# Altium schematic sheet Control.SchDoc
size A4
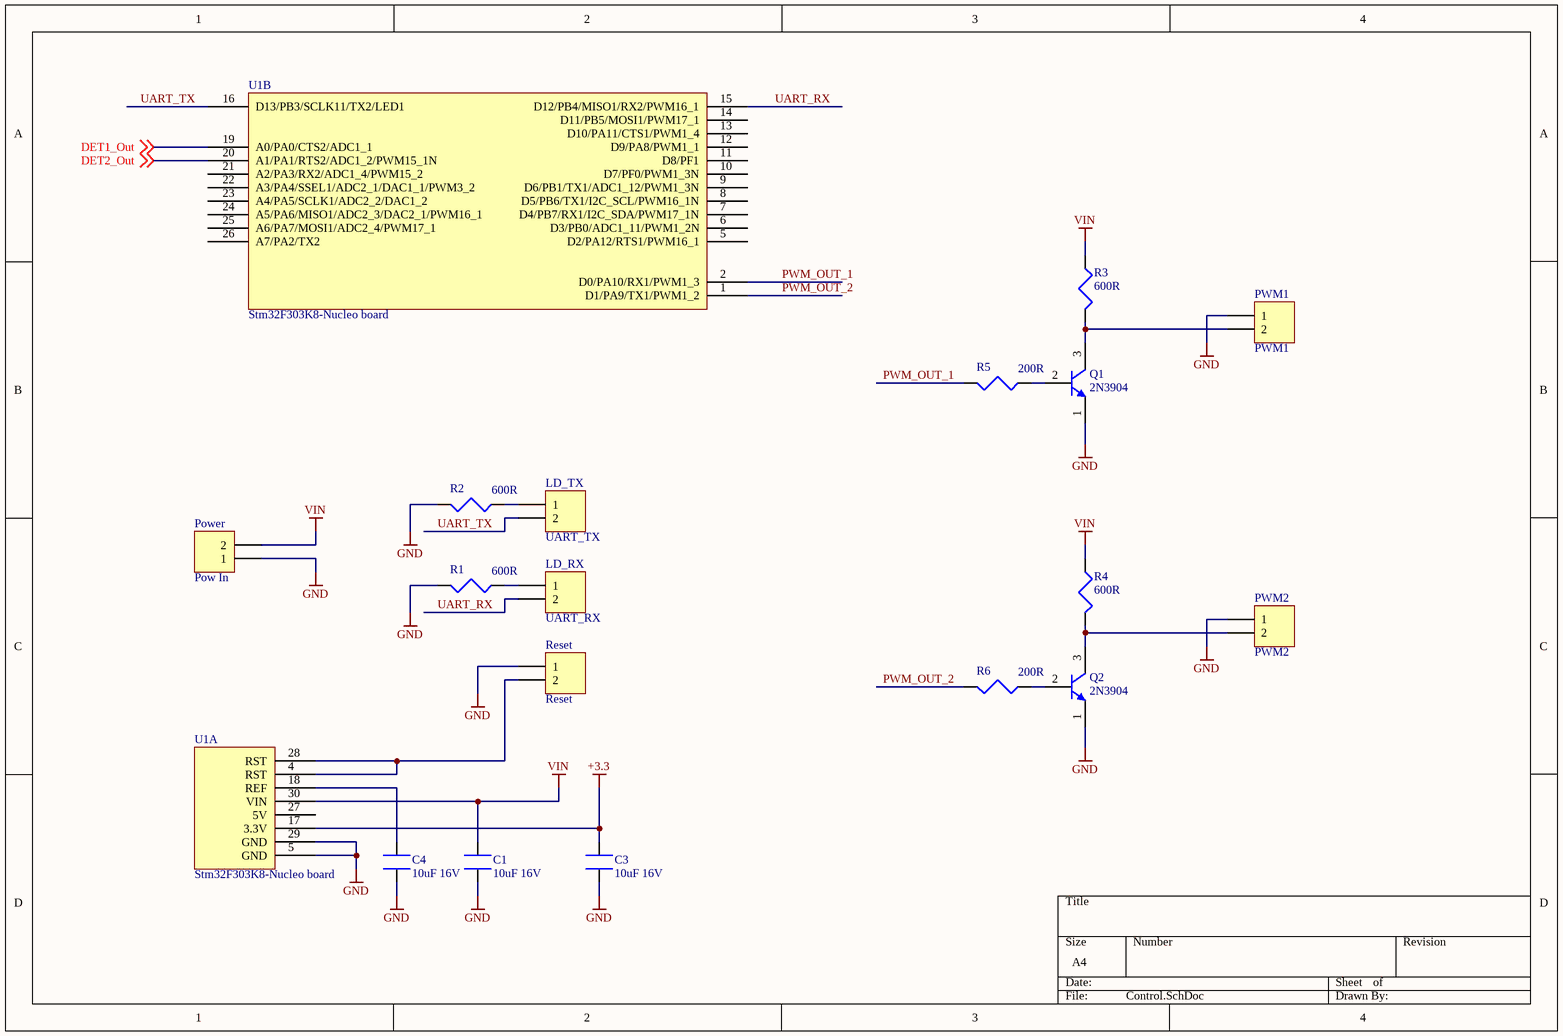
[diagram p0: Control.SchDoc]

## Parts
C1  10uF 16V  [0805_C]
C3  10uF 16V  [0805_C]
C4  10uF 16V  [0805_C]
LD_RX  UART_RX  [HDR1X2]
LD_TX  UART_TX  [HDR1X2]
Power  Pow In  [HDR1X2]
PWM1  PWM1  [HDR1X2]
PWM2  PWM2  [HDR1X2]
Q1  2N3904  [ONSC-TO-92-3-29-11]
Q2  2N3904  [ONSC-TO-92-3-29-11]
R1  600R  [0805_R]
R2  600R  [0805_R]
R3  600R  [0805_R]
R4  600R  [0805_R]
R5  200R  [0805_R]
R6  200R  [0805_R]
Reset  Reset  [HDR1X2]
U1  Stm32F303K8-Nucleo board  [F303-Nucleo]  (parts A,B of 2)

## Nets
+3.3: C3.1 U1.17(3.3V)
GND: C1.2 C3.2 C4.2 Power.1 PWM1.1 PWM2.1 Q1.1(E) Q2.1(E) R1.1 R2.1 Reset.1 U1.5(GND) U1.29(GND)
VIN: C1.1 Power.2 R3.2 R4.2 U1.30(VIN)
DET1_Out: U1.19(A0/PA0/CTS2/ADC1_1) ; off-sheet DET1_Out
DET2_Out: U1.20(A1/PA1/RTS2/ADC1_2/PWM15_1N) ; off-sheet DET2_Out
PWM_OUT_1: R5.1 U1.2(D0/PA10/RX1/PWM1_3)
PWM_OUT_2: R6.1 U1.1(D1/PA9/TX1/PWM1_2)
UART_RX: LD_RX.2 U1.15(D12/PB4/MISO1/RX2/PWM16_1)
UART_TX: LD_TX.2 U1.16(D13/PB3/SCLK11/TX2/LED1)
NetC4_1: C4.1 U1.18(REF)
NetLD_RX_1: LD_RX.1 R1.2
NetLD_TX_1: LD_TX.1 R2.2
NetPWM1_2: PWM1.2 Q1.3(C) R3.1
NetPWM2_2: PWM2.2 Q2.3(C) R4.1
NetQ1_2: Q1.2(B) R5.2
NetQ2_2: Q2.2(B) R6.2
NetReset_2: Reset.2 U1.4(RST) U1.28(RST)

Not connected (* = marked no-connect by the designer): U1 6(D3/PB0/ADC1_11/PWM1_2N) 7(D4/PB7/RX1/I2C_SDA/PWM17_1N) 8(D5/PB6/TX1/I2C_SCL/PWM16_1N) 9(D6/PB1/TX1/ADC1_12/PWM1_3N) 10(D7/PF0/PWM1_3N) 11(D8/PF1) 12(D9/PA8/PWM1_1) 13(D10/PA11/CTS1/PWM1_4) 14(D11/PB5/MOSI1/PWM17_1) 21(A2/PA3/RX2/ADC1_4/PWM15_2) 22(A3/PA4/SSEL1/ADC2_1/DAC1_1/PWM3_2) 23(A4/PA5/SCLK1/ADC2_2/DAC1_2) 24(A5/PA6/MISO1/ADC2_3/DAC2_1/PWM16_1) 25(A6/PA7/MOSI1/ADC2_4/PWM17_1) 26(A7/PA2/TX2) 27(5V)

## Library data of the parts
C1 C3 C4 = Cap
LD_RX LD_TX Power PWM1 PWM2 Reset = Header 2: Header, 2-Pin; LatestRevisionDate: 17-Jul-2002; LatestRevisionNote: Re-released for DXP Platform.; Publisher: Altium Limited
Q1 Q2 = CMP-2000-05562-1: General Purpose Transistor, NPN Silicon, 200 mA, 60 V, -55 to 150 degC, 3-Pin TO-92, RoHS, Bulk; Manufacturer: ONSemiconductor; Emitter- Base Voltage VEBO: 6V; Maximum Power Dissipation: 625mW; Maximum DC Collector Current: 0.2A; Collector- Emitter Voltage VCEO Max: 40V; Collector- Base Voltage VCBO: 60V; DC Collector/Base Gain hfe Min: 60; Configuration: Single; Collector-Emitter Saturation Voltage: 0.3V; Gain Bandwidth Product fT: 270MHz; Mounting Style: ThroughHole; Package / Case: TO-92-3(TO-226); Mounting Technology: ThroughHole; Minimum Operating Temperature: -65C; Datasheet Version: Rev. 8, 08/2012; Product Category: BipolarTransistors-BJT; Factory Pack Quantity: 5000; Transistor Polarity: NPN; Package Description: 3-Pin Transistor Outline, Body 4.825 x 3.685 mm, Pitch 1.27 mm; RoHS: Details; Datasheet URL: https://datasheet.ciiva.com/4725/2n3903-d-285841-4725808.pdf; Packaging: Bulk; Maximum Operating Temperature: +150C; Package Reference: TO-92-3-29-11; Brand: ONSemiconductor; Manufacturer URL: http://www.onsemi.com/
R1-R6 = Res
U1 = F303-Nucleo